# EAGLE design kitchenClock_v3 (EAGLE 6.1)
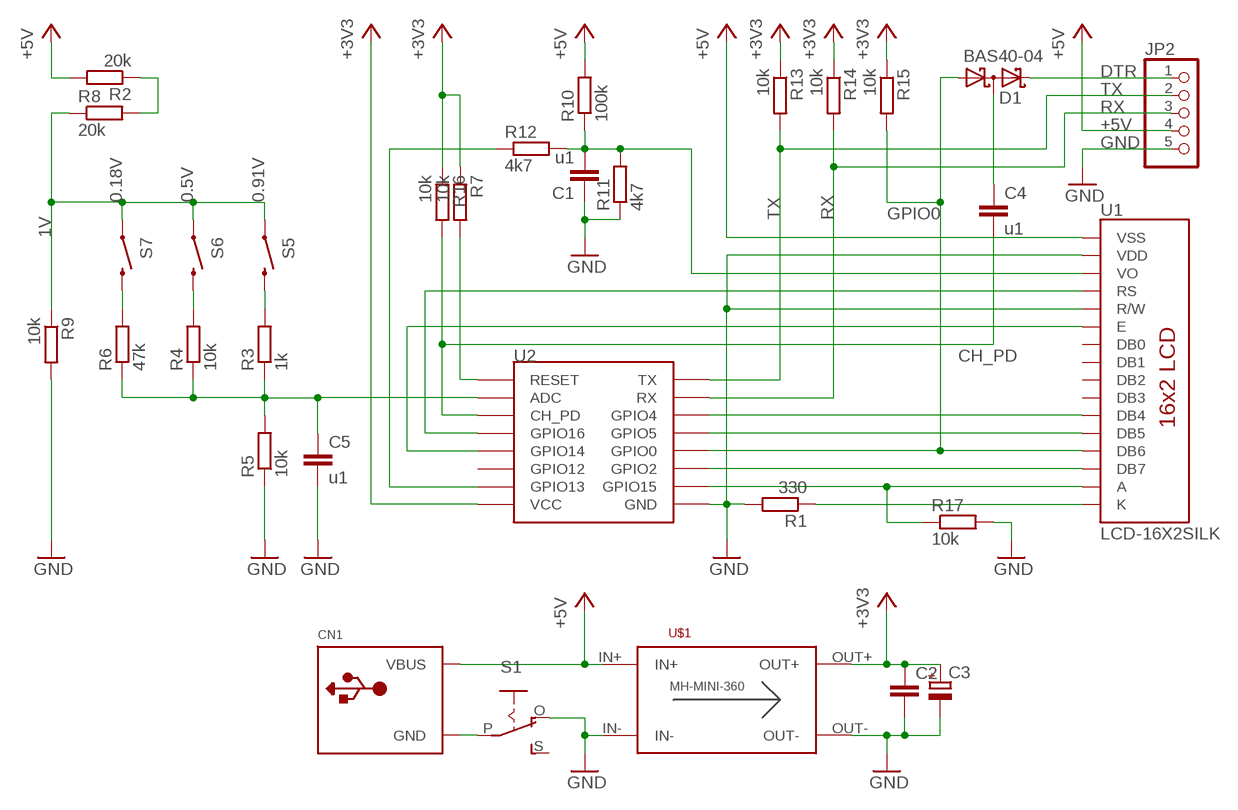
[diagram p0: schematic, sheet 1]

## Parts
C1  u1  C-EU075-032X103  [C075-032X103]
C2  C-EU025-025X050  [C025-025X050]
C3  CPOL-EUTT2D5L  [TT2D5L]
C4  u1  C-EU075-032X103  [C075-032X103]
C5  u1  C-EU025-025X050  [C025-025X050]
CN1  USBPWR-ONLY  [USB-MINIB-THM]
D1  BAS40-04  [SOT23]
JP2  PINHD-1X5/90  [1X05/90]
R1  330  R-EU_M0805  [M0805]
R2  20k  R-EU_0204/7  [0204/7]
R3  1k  R-EU_0204/7  [0204/7]
R4  10k  R-EU_0204/7  [0204/7]
R5  10k  R-EU_0204/7  [0204/7]
R6  47k  R-EU_0204/7  [0204/7]
R7  10k  R-EU_0204/7  [0204/7]
R8  20k  R-EU_0204/7  [0204/7]
R9  10k  R-EU_0204/7  [0204/7]
R10  100k  R-EU_M0805  [M0805]
R11  4k7  R-EU_0204/7  [0204/7]
R12  4k7  R-EU_0207/10  [0207/10]
R13  10k  R-EU_0207/10  [0207/10]
R14  10k  R-EU_0207/10  [0207/10]
R15  10k  R-EU_0207/10  [0207/10]
R16  10k  R-EU_M0805  [M0805]
R17  10k  R-EU_M0805  [M0805]
S1  EG1218S  [EG1218]
S5  SWITCH-MOMENTARY-2SIDE_EZ  [TACTILE-PTH-SIDEEZ]
S6  SWITCH-MOMENTARY-2SIDE_EZ  [TACTILE-PTH-SIDEEZ]
S7  SWITCH-MOMENTARY-2SIDE_EZ  [TACTILE-PTH-SIDEEZ]
U1  LCD-16X2SILK  [LCD-16X2]
U2  ESP12EDIP  [ESP-12-BREAKOUT]
U$1  DC-DC_CONV_MINISTD  [DC-DC_CONV_MINI]

## Nets
1V: R8.1 R9.1 S5.1 S6.1 S7.1
+3V3: C2.1 C3.+ R7.1 R13.1 R14.1 R15.1 R16.1 U2.P$1(VCC) U$1.OUT+
+5V: CN1.VBUS JP2.4 R2.2 R10.2 U1.1(VSS) U$1.IN+
CH_PD: C4.2 R16.2 U2.P$6(CH_PD)
DTR: D1.2(C2) JP2.1
GND: C1.1 C2.2 C3.- C5.2 JP2.5 R1.2 R5.1 R9.2 R11.1 R17.2 S1.O U1.2(VDD) U1.5(R/W) U2.P$9(GND) U$1.IN- U$1.OUT-
GPIO0: D1.1(A1) R15.2 U1.13(DB6) U2.P$12(GPIO0)
N$1: R1.1 U1.16(K)
N$2: R12.1 U2.P$2(GPIO13)
N$3: U1.4(RS) U2.P$5(GPIO16)
N$4: U1.6(E) U2.P$4(GPIO14)
N$5: U1.11(DB4) U2.P$14(GPIO4)
N$6: U1.12(DB5) U2.P$13(GPIO5)
N$7: R3.2 S5.2
N$8: U1.14(DB7) U2.P$11(GPIO2)
N$9: R17.1 U1.15(A) U2.P$10(GPIO15)
N$10: C5.1 R3.1 R4.1 R5.2 R6.1 U2.P$7(ADC)
N$11: R4.2 S6.2
N$12: CN1.GND CN1.GND1(GND) CN1.GND2(GND) CN1.GND3(GND) CN1.GND4(GND) S1.P
N$13: R6.2 S7.2
N$14: R7.2 U2.P$8(RESET)
N$15: R2.1 R8.2
N$18: C4.1 D1.3(C1A2)
N$19: C1.2 R10.1 R11.2 R12.2 U1.3(VO)
RX: JP2.3 R14.2 U2.P$15(RX)
TX: JP2.2 R13.2 U2.P$16(TX)
Unconnected: S1.S U1.7(DB0) U1.8(DB1) U1.9(DB2) U1.10(DB3) U2.P$3(GPIO12)

## Notes on the sheet
- 0.18V | 0.5V | 0.91V

## Library data of the parts
C1 C2 C4 C5 = rcl:C-EU: CAPACITOR, European symbol
C3 = rcl:CPOL-EU: POLARIZED CAPACITOR, European symbol
CN1 = _MY_OWN_LIB:USB: USB Connectors USBMINIB - Surface Mount Female Mini-B USB Connector 4UConnector: 06564 By microbuilder.eu Thru-hole RA Female Mini-B USB Connector 4UConnector: 18732 By ladyada.net
D1 = diode:BAS40-04: Silicon Schottky Diodes General-purpose diode for high-speed switching
JP2 = pinhead:PINHD-1X5: PIN HEADER
R1-R17 = rcl:R-EU_: RESISTOR, European symbol
S1 = _MY_OWN_LIB:EG1218: SLIDING SWITCH 0.1" spacing through hole, vertical SPDT slide switch http://www.ladyada.net/library/pcb/eaglelibrary.html
S5-S7 = SparkFun-Electromechanical:SWITCH-MOMENTARY-2: Various NO switches- pushbuttons, reed, etc
U1 = SparkFun-Displays:LCD-16X2: Standard text-only 16x2 parallel input LCD
U2 = _MY_OWN_LIB:ESP12E: ESP12E Module
U$1 = _MY_OWN_LIB:DC-DC_CONV_MINI

## Board
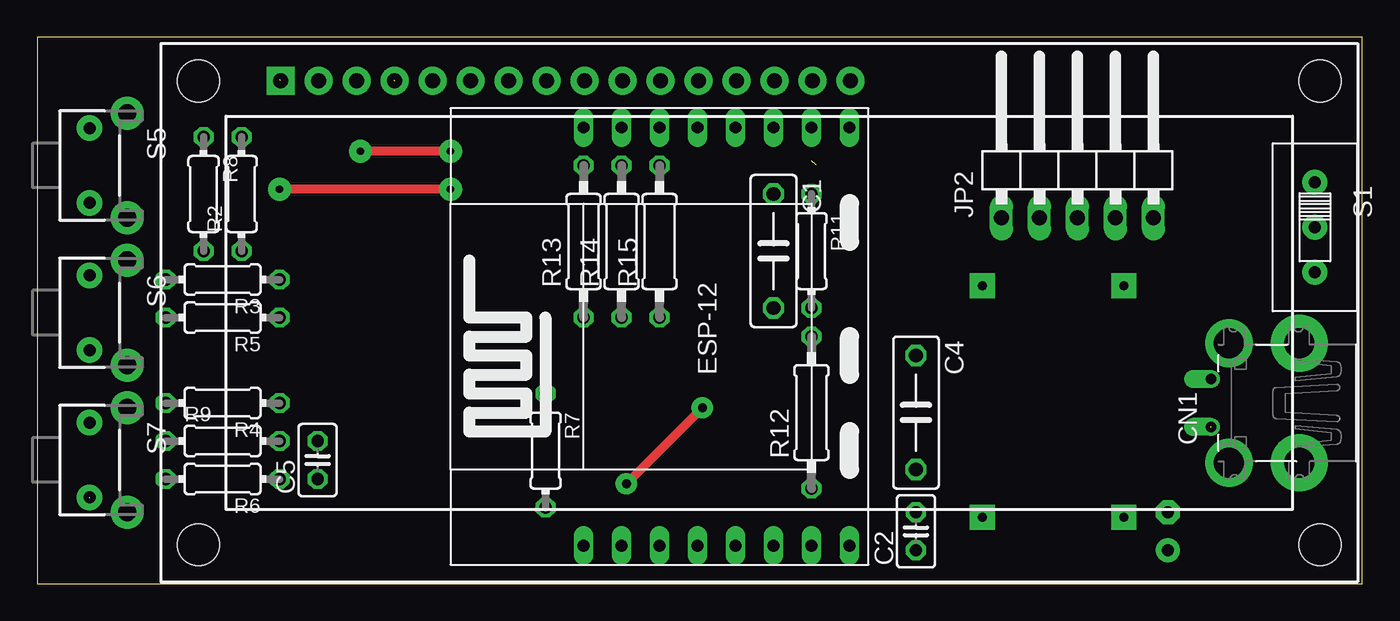
[diagram p1: board, top side]
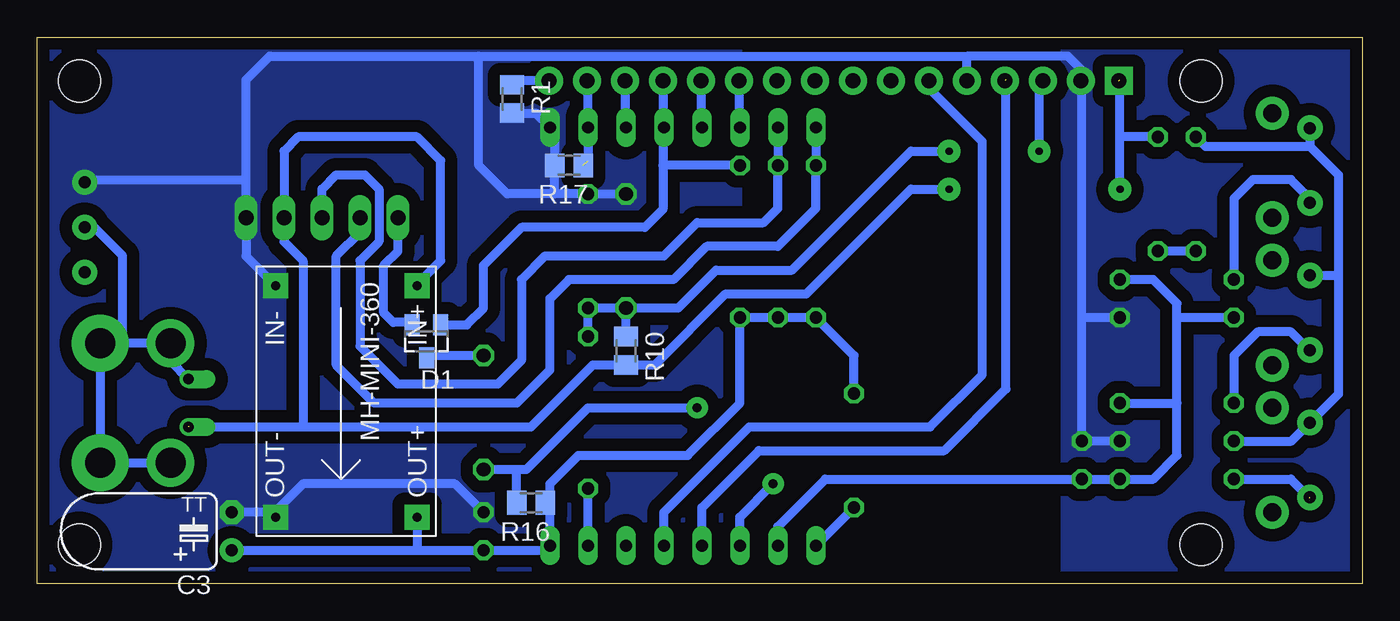
[diagram p2: board, bottom side, seen from below]

Size 88.56 x 36.5 mm. Coordinates in mm from the lower left corner, seen from the top.
Outline: 0,0 88.56,0 88.56,36.5 0,36.5 0,0
Copper layers (1*16): Top 0.035mm / dielectric 1.5mm / Bottom 0.035mm
Design rules: minimum track width 10mil, minimum drill 24mil, track to track 12mil, track to pad 12mil, pad to pad 12mil, via to via 12mil, smd to smd 10mil, copper to edge 12mil, drill to drill 12mil, minimum pad ring 10mil, minimum via ring 10mil, stop-mask expansion 4mil, vias tented up to drill 0mil, thermal gap 12mil

### Footprints (pad centres in the part's own frame; a part is rotated, then mirrored left to right if it is on the bottom)
C075-032X103 = drill 0.914 octagon: 1 -3.81,0; 2 3.81,0
C025-025X050 = drill 0.813 octagon: 1 -1.27,0; 2 1.27,0
TT2D5L = drill 0.813 pad 1.6: + -1.27,0 | drill 0.813 pad 1.6 octagon: - 1.27,0
USB-MINIB-THM = drill 0.7 offset: GND 1.6,9.8; VBUS -1.6,9.8 | drill 2 pad 3.81: GND1 -4,3.9; GND4 4,3.9 | drill 2 pad 3.2: GND2 -4,8.6; GND3 4,8.6
SOT23 = smd 1 x 1.4: 1 -0.95,-1.1; 2 0.95,-1.1; 3 0,1.1
1X05/90 = drill 1.016 long: 1 -5.08,-3.81; 2 -2.54,-3.81; 3 0,-3.81; 4 2.54,-3.81; 5 5.08,-3.81
M0805 = smd 1.3 x 1.6: 1 -0.95,0; 2 0.95,0
0204/7 = drill 0.813 octagon: 1 -3.81,0; 2 3.81,0
0207/10 = drill 0.813 octagon: 1 -5.08,0; 2 5.08,0
EG1218 = drill 0.8 pad 1.676: O -3,0; P 0,0; S 3,0
TACTILE-PTH-SIDEEZ = drill 0.8 pad 1.7: 1 -2.5,0; 2 2.5,0 | drill 1.2 pad 2.2: ANCHOR1 -3.5,2.5; ANCHOR2 3.5,2.5
LCD-16X2 = drill 1.016 pad 1.88 square: 1 -32,15.5 | drill 1.016 pad 1.88: 2 -29.46,15.5; 3 -26.92,15.5; 4 -24.38,15.5; 5 -21.84,15.5; 6 -19.3,15.5; 7 -16.76,15.5; 8 -14.22,15.5; 9 -11.68,15.5; 10 -9.14,15.5; 11 -6.6,15.5; 12 -4.06,15.5; 13 -1.52,15.5; 14 1.02,15.5; 15 3.56,15.5; 16 6.1,15.5 | hole 2.8: -37.5,15.5; -37.5,-15.5; 37.5,15.5; 37.5,-15.5
ESP-12-BREAKOUT = drill 0.8 long: P$1 0,0; P$2 0,2.54; P$3 0,5.08; P$4 0,7.62; P$5 0,10.16; P$6 0,12.7; P$7 0,15.24; P$8 0,17.78; P$9 27.94,0; P$10 27.94,2.54; P$11 27.94,5.08; P$12 27.94,7.62; P$13 27.94,10.16; P$14 27.94,12.7; P$15 27.94,15.24; P$16 27.94,17.78
DC-DC_CONV_MINI = drill 0.6 pad 1.676 square: IN+ 16.73,1.27; IN- 16.73,10.73; OUT+ 1.27,1.27; OUT- 1.27,10.73

### Placement (x,y rotation side)
C1  49.21,22.23 270 top
C2  58.74,3.49 90 top
C3  75.56,3.49 90 bottom
C4  58.74,11.43 270 top
C5  18.73,8.26 90 top
CN1  88.27,12.06 90 top
D1  62.55,16.19 180 bottom
JP2  69.53,28.26 0 top
R1  56.83,32.38 270 bottom
R2  13.65,26.04 90 top
R3  12.38,20.32 180 top
R4  12.38,12.06 180 top
R5  12.38,17.78 180 top
R6  12.38,6.99 180 top
R7  33.97,8.89 270 top
R8  11.11,26.04 270 top
R9  12.38,9.53 0 top
R10  49.21,15.56 270 bottom
R11  51.75,22.23 270 top
R12  51.75,11.43 90 top
R13  36.51,22.86 90 top
R14  39.05,22.86 90 top
R15  41.59,22.86 90 top
R16  55.56,5.4 180 bottom
R17  53.02,27.94 180 bottom
S1  85.41,23.81 270 top
S5  3.49,27.94 270 top
S6  3.49,18.1 270 top
S7  3.49,8.26 270 top
U1  48.26,18.1 0 top
U2  54.29,2.54 90 top
U$1  61.91,3.17 90 bottom

### Tracks (layer width: path | path; a pad name or v marks a point on that pad's centre or on a via)
1V
  Bottom 0.61: 1.59,20.64 1.59,27.3 3.49,29.21 | 1.59,20.64 1.59,12.66 S7.1 4.72,9.53 R9.1 | S6.1 1.63,20.6 1.59,20.64 | R8.1 10.48,29.21 3.49,29.21 | S5.1 3.49,29.21
+3V3
  Bottom 0.61: C3.+ 63.18,2.22 | 63.18,2.22 C2.1 54.61,2.22 U2.P$1 54.29,5.4 | 54.29,5.4 54.29,6.67 52.39,8.57 45.09,8.57 41.59,12.06 R15.1 R14.1 R13.1 33.97,15.24 R7.1 | R16.1 54.29,5.4 | U$1.OUT+ 63.18,2.22
+5V  (via drill 0.5 pad 1.52)  (2 unrouted)
  Top 0.61: v27.62,26.35 v16.19,26.35
  Bottom 0.61: 78.42,10.48 70.8,10.48 | 70.8,10.48 55.56,10.48 51.44,14.61 R10.2 | R10.2 47.31,14.61 42.55,19.37 37.15,19.37 30.16,26.35 v27.62,26.35 | R10.2 | U$1.IN+ 63.18,20 61.59,21.59 61.59,28.26 63.18,29.84 71.12,29.84 72.07,28.89 JP2.4 72.07,22.86 70.8,21.59 70.8,10.48 | v16.19,26.35 16.19,29.84 | 16.19,29.84 16.19,33.66 | R2.2 16.19,29.84
CH_PD  (via drill 0.6 pad 1.42)
  Top 0.61: v39.37,6.67 v44.45,11.75
  Bottom 0.61: U2.P$6 41.59,4.45 v39.37,6.67 | 56.52,7.62 55.88,7.62 51.75,11.75 v44.45,11.75 | 56.52,7.62 C4.2 | R16.2 56.51,7.62 56.52,7.62
DTR
  Bottom 0.61: D1.2 63.5,17.46 64.77,17.46 65.41,18.1 65.41,21.27 64.45,22.23 JP2.1
GND
  Bottom 0.61: 26.35,35.24 19.69,35.24 18.73,34.29 18.73,33.66 | U1.5 26.42,35.17 26.35,35.24 | 59.06,35.24 73.03,35.24 74.61,33.66 74.61,26.99 | 59.06,35.24 26.35,35.24 | S1.O 85.41,26.99 74.61,26.99 | 74.61,26.99 JP2.5 74.61,21.88 U$1.IN- | C1.1 R11.1 53.98,26.04 | C2.2 60.64,6.67 70.8,6.67 72.71,4.76 | 72.71,4.76 C3.- | U$1.OUT- 72.64,4.7 72.71,4.76 | 53.98,26.04 57.15,26.04 59.06,27.94 59.06,35.24 | R1.2 55.25,31.43 U2.P$9 53.98,30.16 R17.2 53.98,26.04 | 18.73,17.78 18.73,33.66 | U1.2 18.73,33.66 | R5.1 18.73,17.78 | R9.2 C5.2 18.73,17.78
  pour Bottom (isolate 0.813, no thermals): 41.59,0 88.58,0 88.58,36.51 41.59,36.51
  pour Bottom (isolate 0.813, no thermals): 0,-0.32 20,-0.32 20,36.51 0,36.51
GPIO0
  Bottom 0.61: U1.13 46.74,30.48 | U2.P$12 46.74,30.48 | 46.74,30.48 46.74,27.94 | 46.74,27.94 46.74,25.02 47.94,23.81 56.2,23.81 58.74,21.27 58.74,18.41 59.86,17.29 D1.1 | R15.2 46.74,27.94
N$1
  Bottom 0.61: U1.16 56.57,33.6 R1.1
N$2
  Bottom 0.61: U2.P$2 R12.1
N$3  (1 unrouted)
  Bottom 0.61: U2.P$5 44.13,5.08 40.32,8.89 27.94,8.89 23.81,13.02 23.81,33.66
N$4
  Bottom 0.61: U2.P$4 46.67,4.76 40.96,10.48 28.89,10.48 25.4,13.97 25.4,29.53 28.96,33.09 U1.6
N$5
  Bottom 0.61: U1.11 41.66,30.55 U2.P$14
N$6
  Bottom 0.61: U1.12 44.2,30.55 U2.P$13
N$7
  Bottom 0.61: S5.2 3.49,25.72 4.76,26.99 7.3,26.99 8.57,25.72 R3.2
N$8
  Bottom 0.61: U1.14 49.28,30.55 U2.P$11
N$9  (1 unrouted)
  Bottom 0.61: 51.75,28.26 U2.P$10 51.75,33.53 U1.15
N$10
  Bottom 0.61: U2.P$7 39.05,3.81 35.88,6.99 C5.1 R6.1 13.97,6.99 12.38,8.57 12.38,12.06 | 12.38,12.06 12.38,17.78 | 12.38,17.78 12.38,18.73 13.97,20.32 R3.1 | R5.2 12.38,17.78 | R4.1 12.38,12.06
N$11
  Bottom 0.61: S6.2 3.53,15.6 4.76,16.83 6.99,16.83 8.57,15.24 R4.2
N$12
  Bottom 0.61: CN1.GND4 CN1.GND1 CN1.GND2 | CN1.GND 79.67,14.87 CN1.GND3 CN1.GND4 | CN1.GND4 83,16.07 82.87,16.19 82.87,21.91 84.77,23.81 S1.P
N$13  (1 unrouted)
  Bottom 0.61: R6.2 4.76,6.99 3.49,5.71
N$14
  Bottom 0.61: U2.P$8 R7.2
N$15
  Bottom 0.61: R8.2 R2.1
N$18
  Bottom 0.61: C4.1 62.4,15.24 D1.3
N$19  (via drill 0.5 pad 1.52)
  Top 0.61: v27.62,28.89 v21.59,28.89
  Bottom 0.61: v21.59,28.89 21.59,33.35 U1.3 | C1.2 45.72,18.41 43.18,20.95 38.1,20.95 30.16,28.89 v27.62,28.89 | C1.2 R11.2 R12.2 | R10.1 C1.2
RX
  Bottom 0.61: U2.P$15 R14.2 39.05,25.08 40.01,24.13 44.45,24.13 46.67,21.91 54.61,21.91 56.2,20.32 56.2,14.92 57.79,13.34 64.45,13.34 66.99,15.88 66.99,21.59 65.72,22.86 65.72,26.35 66.68,27.3 68.58,27.3 69.53,26.35 JP2.3
TX
  Bottom 0.61: U2.P$16 R13.2 36.51,25.08 39.05,22.54 43.82,22.54 46.04,20.32 53.02,20.32 54.29,19.05 54.29,14.29 56.52,12.06 66.04,12.06 68.58,14.61 68.58,21.91 66.99,23.5 JP2.2